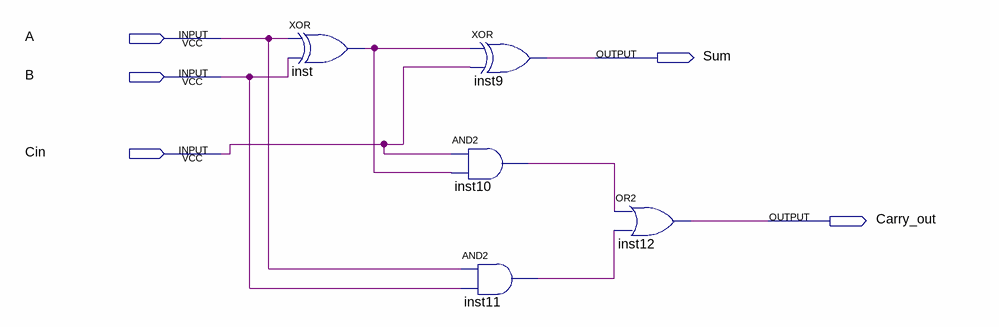
[diagram p0: schematic sheet]
// Quartus schematic faboard.bdf as structural Verilog: 5 symbols, 5 pins
module faboard (
  input  A,
  input  B,
  input  Cin,
  output Sum,
  output Carry_out
);

  wire inst10_out, inst11_out, inst_out;

  xor inst (inst_out, A, B);
  and inst10 (inst10_out, Cin, inst_out);
  xor inst9 (Sum, inst_out, Cin);
  and inst11 (inst11_out, A, B);
  or inst12 (Carry_out, inst10_out, inst11_out);
endmodule
